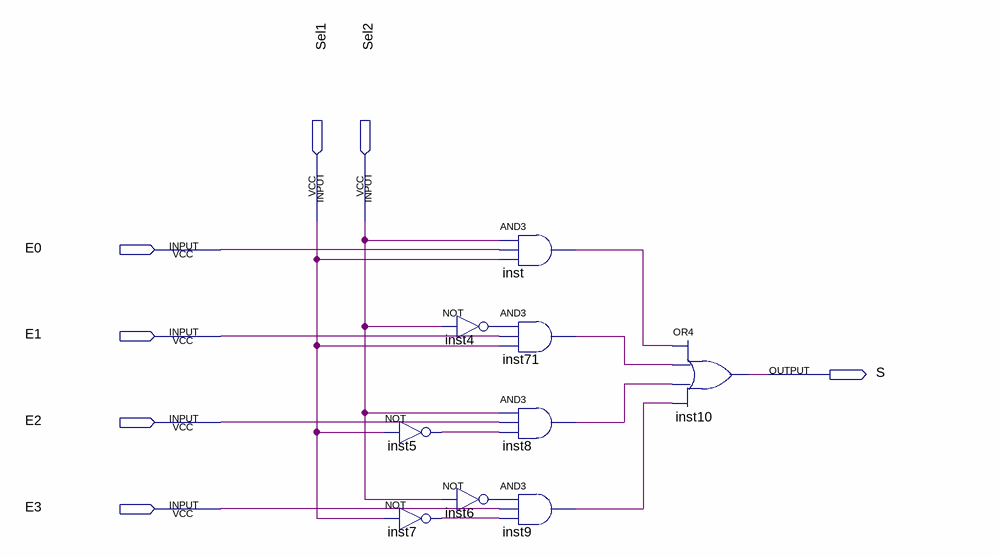
[diagram p0: schematic sheet]
// Quartus schematic multiplex.bdf as structural Verilog: 9 symbols, 7 pins
module multiplex (
  input  Sel1,
  input  Sel2,
  input  E0,
  input  E1,
  input  E2,
  input  E3,
  output S
);

  wire inst4_out, inst5_out, inst6_out, inst7_out, inst8_out, inst9_out, inst71_out, inst_out;

  not inst5 (inst5_out, Sel1);
  not inst7 (inst7_out, Sel1);
  not inst4 (inst4_out, Sel2);
  not inst6 (inst6_out, Sel2);
  and inst (inst_out, Sel2, E0, Sel1);
  and inst71 (inst71_out, inst4_out, E1, Sel1);
  and inst8 (inst8_out, Sel2, E2, inst5_out);
  and inst9 (inst9_out, inst6_out, E3, inst7_out);
  or inst10 (S, inst_out, inst71_out, inst8_out, inst9_out);
endmodule
